# EAGLE design node (EAGLE 7.6.0)
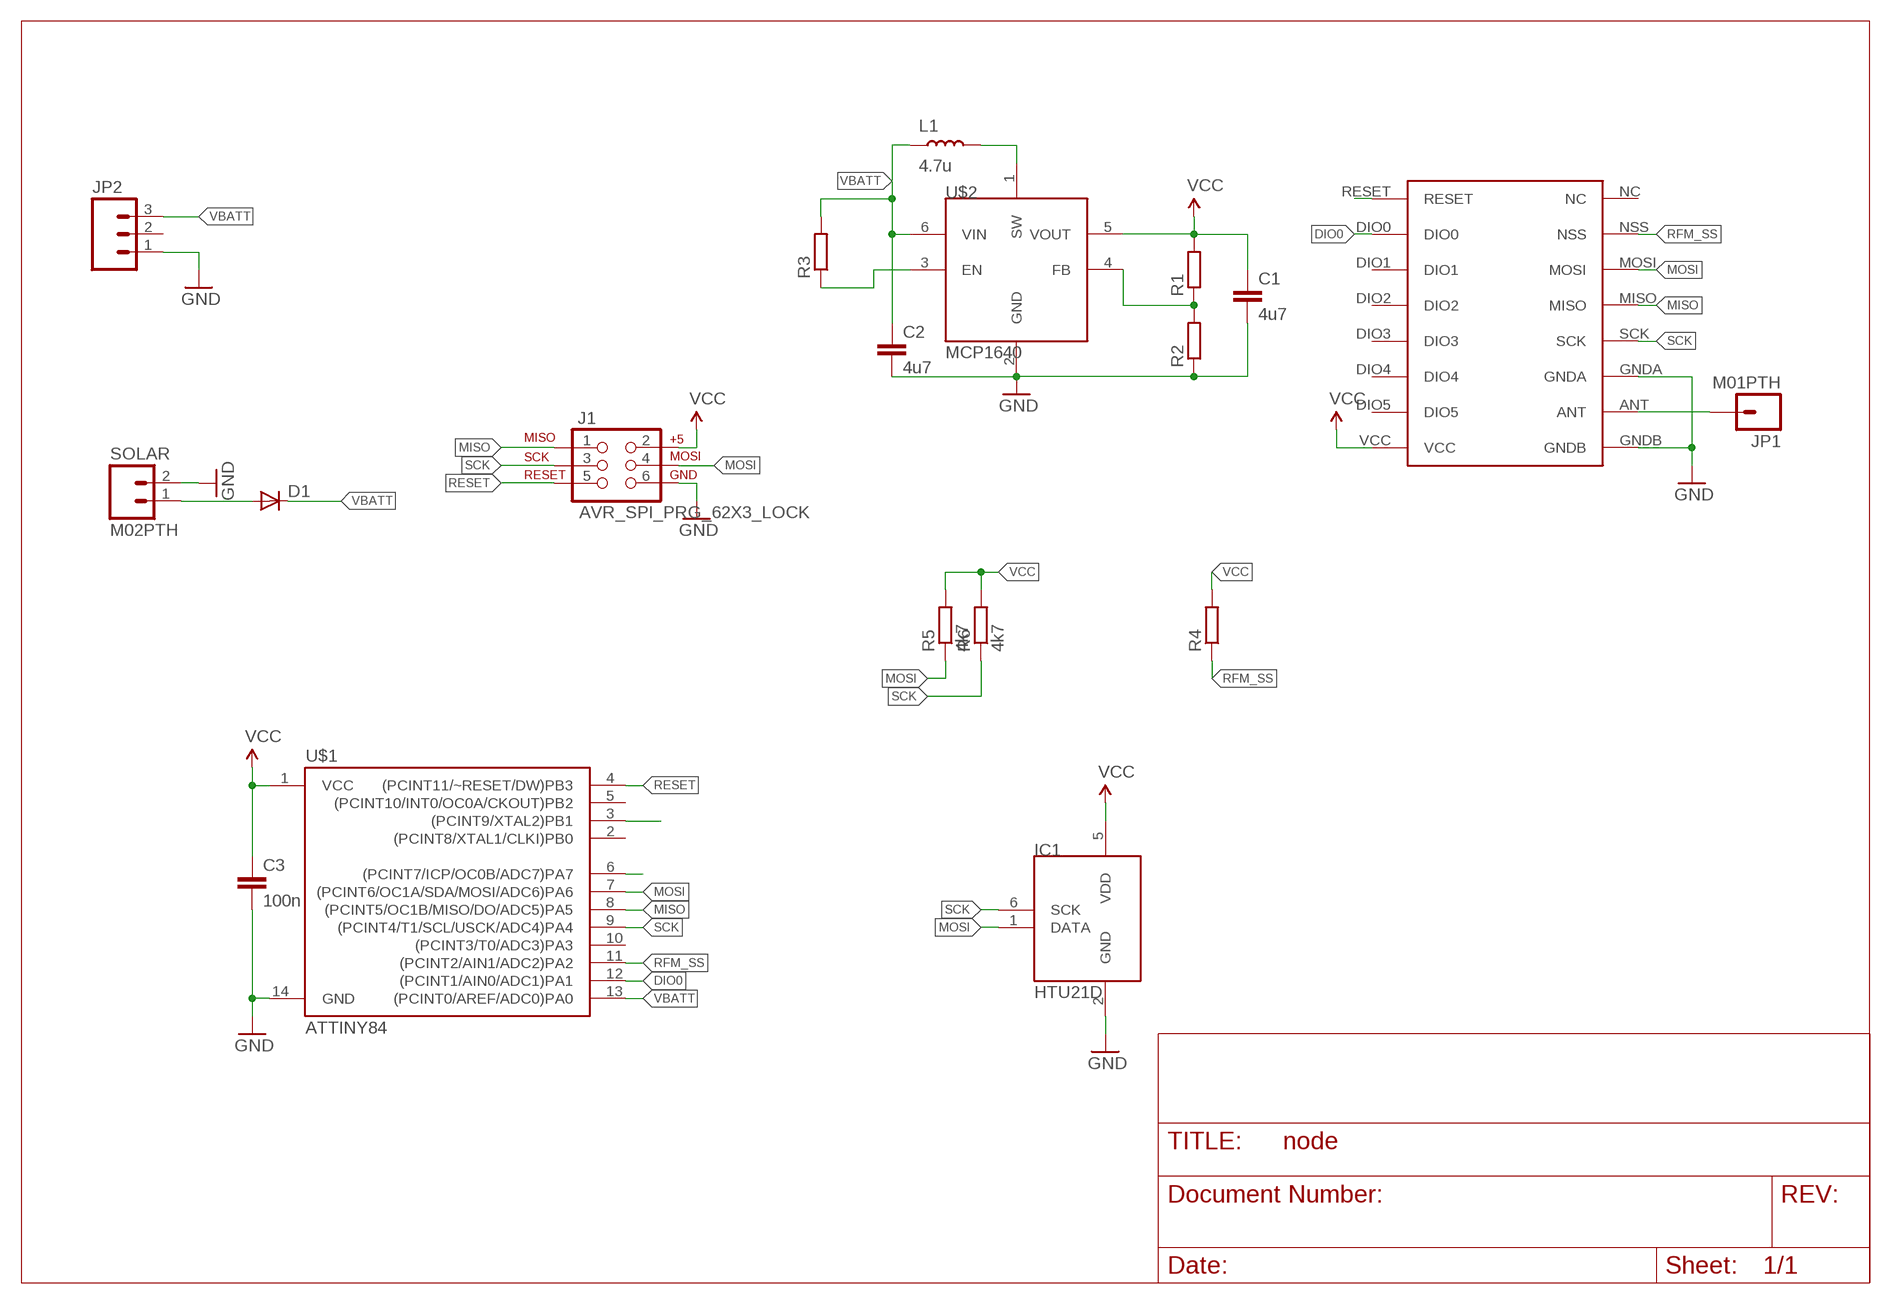
[diagram p0: schematic, sheet 1]

## Parts
C1  4u7  C-EUC0603  [C0603]
C2  4u7  C-EUC0603  [C0603]
C3  100n  C-EUC0603  [C0603]
D1  DIODE-SOD123  [SOD123]
IC1  HTU21D  [DFN6-L]
J1  AVR_SPI_PRG_62X3_LOCK  [2X3_LOCK]
JP1  M01PTH  [1X01]
JP2  M03PTH  [1X03]
L1  4.7u  INDUCTOR0603-N  [L0603-N]
R1  R-EU_R0603  [R0603]
R2  R-EU_R0603  [R0603]
R3  R-EU_R0603  [R0603]
R4  R-EU_R0603  [R0603]
R5  4k7  R-EU_R0603  [R0603]
R6  4k7  R-EU_R0603  [R0603]
SOLAR  M02PTH  [1X02]
U$1  ATTINY84  [SO14]
U$2  MCP1640  [SOT23-6]
U$4  RFM69HW  [RFM]

## Nets
DIO0: U$1.12((PCINT1/AIN0/ADC1)PA1) U$4.DIO0
EN: R3.1 U$2.3(EN)
GND: C1.2 C2.2 C3.2 IC1.2(GND) J1.6 JP2.1 R2.1 SOLAR.2 U$1.14(GND) U$2.2(GND) U$4.GNDA U$4.GNDB
MISO: J1.1 U$1.8((PCINT5/OC1B/MISO/DO/ADC5)PA5) U$4.MISO
MOSI: IC1.1(DATA) J1.4 R5.1 U$1.7((PCINT6/OC1A/SDA/MOSI/ADC6)PA6) U$4.MOSI
N$1: L1.2 U$2.1(SW)
N$2: R1.1 R2.2 U$2.4(FB)
N$3: JP1.1 U$4.ANT
N$4: U$1.3((PCINT9/XTAL2)PB1)
N$5: D1.A SOLAR.1
N$6: U$1.6((PCINT7/ICP/OC0B/ADC7)PA7)
N$7: U$4.RESET
RESET: J1.5 U$1.4((PCINT11/~RESET/DW)PB3)
RFM_SS: R4.1 U$1.11((PCINT2/AIN1/ADC2)PA2) U$4.NSS
SCK: IC1.6(SCK) J1.3 R6.1 U$1.9((PCINT4/T1/SCL/USCK/ADC4)PA4) U$4.SCK
VBATT: C2.1 D1.C JP2.3 L1.1 R3.2 U$1.13((PCINT0/AREF/ADC0)PA0) U$2.6(VIN)
VCC: C1.1 C3.1 IC1.5(VDD) J1.2 R1.2 R4.2 R5.2 R6.2 U$1.1(VCC) U$2.5(VOUT) U$4.VCC
Unconnected: JP2.2 U$1.2((PCINT8/XTAL1/CLKI)PB0) U$1.5((PCINT10/INT0/OC0A/CKOUT)PB2) U$1.10((PCINT3/T0/ADC3)PA3) U$4.DIO1 U$4.DIO2 U$4.DIO3 U$4.DIO4 U$4.DIO5 U$4.NC

## Library data of the parts
C1-C3 = rcl:C-EU: CAPACITOR, European symbol
D1 = dtb:DIODE-: DIODE
IC1 = Mine:HTU21D
J1 = SparkFun-Connectors:AVR_SPI_PRG_6: AVR ISP 6 Pin This is the reduced ISP connector for AVR programming. Common on Arduino. This footprint will take up less PCB space and can be used with a 10-pin to 6-pin adapter such as SKU: BOB-08508 **Special note about "TEST_POINT" package. The stop mask is on the top side, so if you want your programming test points to be on the bottom of your board, make sure to place this package on the bottom side of the board. This also ensure that the orientation to program from the bottom side will be correct.
JP1 = SparkFun-Connectors:M01: Header 1 Standard 1-pin 0.1" header. Use with straight break away headers (SKU : PRT-00116), right angle break away headers (PRT-00553), swiss pins (PRT-00743), machine pins (PRT-00117), and female headers (PRT-00115).
JP2 = SparkFun:M03: Header 3 Standard 3-pin 0.1" header. Use with straight break away headers (SKU : PRT-00116), right angle break away headers (PRT-00553), swiss pins (PRT-00743), machine pins (PRT-00117), and female headers (PRT-00115). Molex polarized connector foot print use with SKU : PRT-08232 with associated crimp pins and housings.
L1 = passives-7351:INDUCTOR
R1-R6 = rcl:R-EU_: RESISTOR, European symbol
SOLAR = SparkFun-Connectors:M02: Standard 2-pin 0.1" header. Use with - straight break away headers ( PRT-00116) - right angle break away headers (PRT-00553) - swiss pins (PRT-00743) - machine pins (PRT-00117) - female headers (PRT-00115) Molex polarized connector foot print use with: PRT-08233 with associated crimp pins and housings. 2.54_SCREWTERM for use with PRT-10571. 3.5mm Screw Terminal footprints for PRT-08084 5mm Screw Terminal footprints for use with PRT-08432
U$1 = SparkFun-DigitalIC:ATTINY84: Atmel 14-pin 2/4/8kB flash uC; PROD_ID: IC-11285
U$2 = ukhas:MCP1640
U$4 = hoperf:RFM69HW

## Board
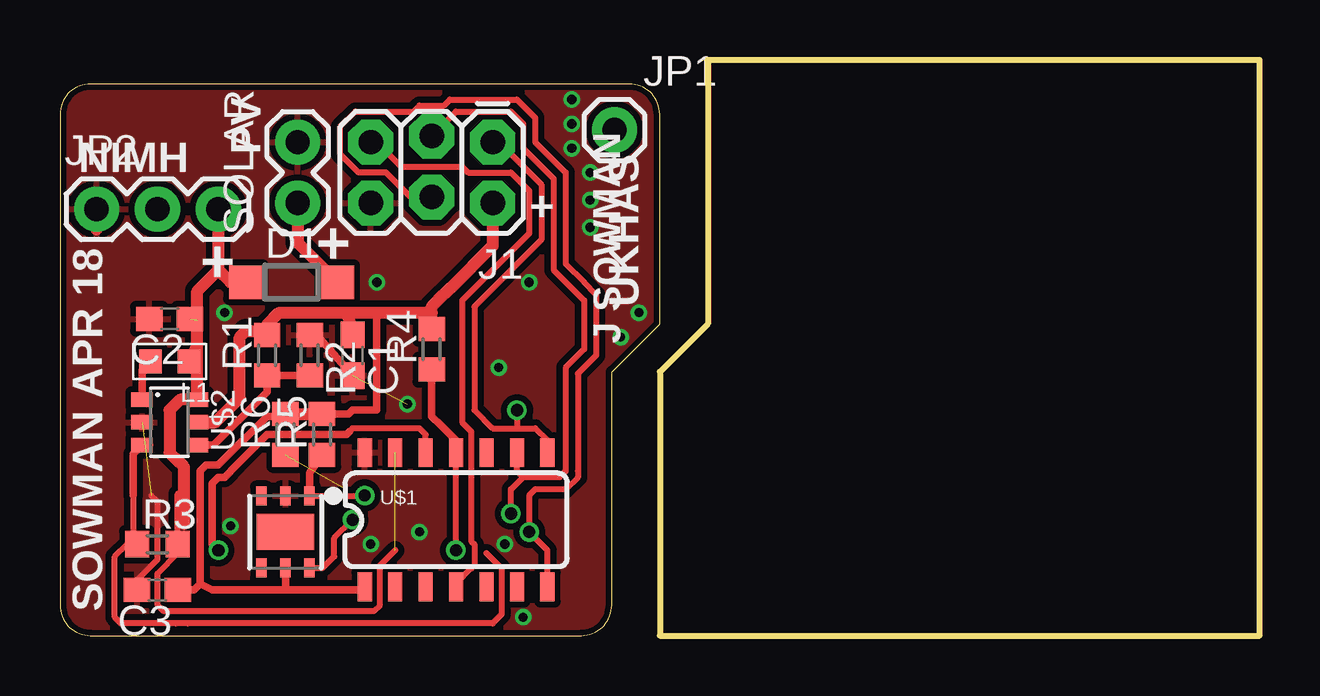
[diagram p1: board, top side]
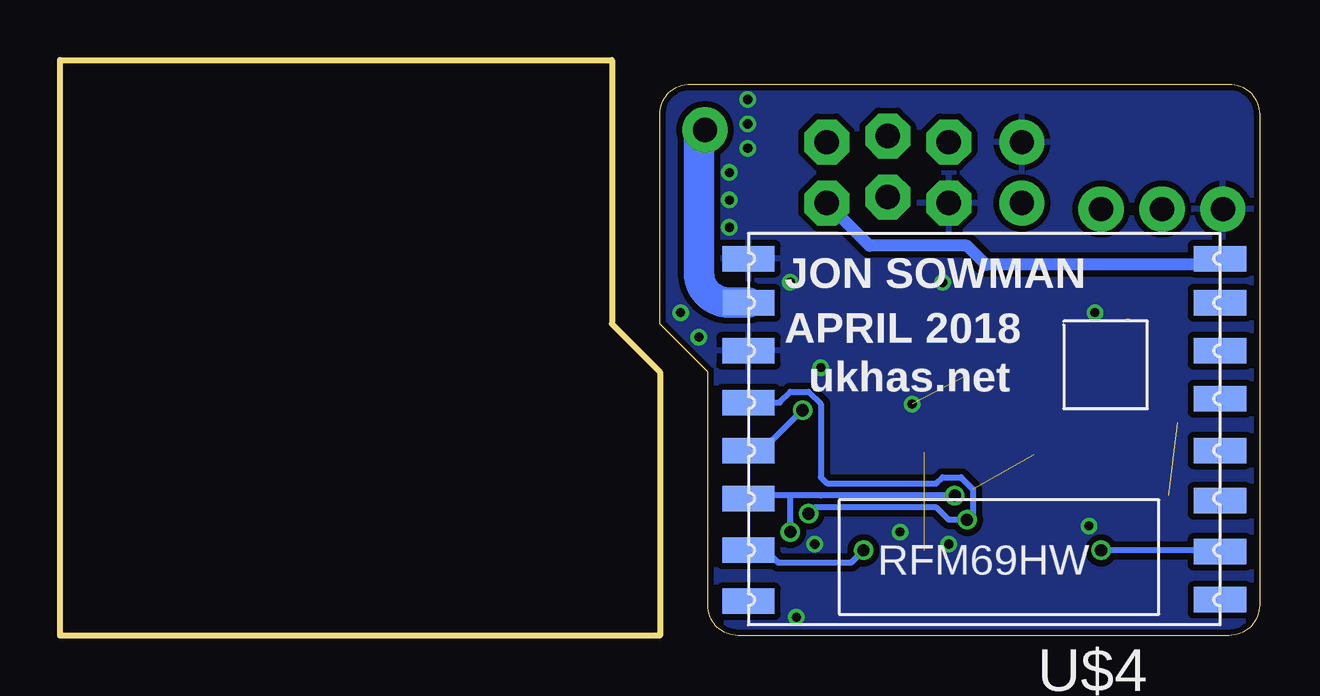
[diagram p2: board, bottom side, seen from below]

Size 50 x 24 mm. Coordinates in mm from the lower left corner, seen from the top.
Outline: 25,13 25,21.73 arc90 23.73,23 1.27,23 arc90 0,21.73 0,1.27 arc90 1.27,0 21.73,0 arc90 23,1.27 23,11 25,13
Outline: 27,24 27,13 25,11 25,0 50,0 50,24 27,24
Copper layers (1*16): Top 0.035mm / dielectric 1.5mm / Bottom 0.035mm
Design rules "dirt_cheap_dirty_boards.v1": minimum track width 5mil, minimum drill 12mil, track to track 5mil, track to pad 5mil, pad to pad 5mil, via to via 5mil, smd to smd 0mil, copper to edge 10mil, drill to drill 10mil, minimum pad ring 10mil, minimum via ring 6mil, stop-mask expansion 2mil, vias tented up to drill 25mil, thermal gap 10mil

### Footprints (pad centres in the part's own frame; a part is rotated, then mirrored left to right if it is on the bottom)
C0603 = smd 1.1 x 1: 1 -0.85,0; 2 0.85,0
SOD123 = smd 1.4 x 1.4: A 1.9,0; C -1.9,0
DFN6-L = smd 0.45 x 0.8: 1 -1,-1.5; 2 0,-1.5; 3 1,-1.5; 4 1,1.5; 5 0,1.5; 6 -1,1.5 | smd 2.4 x 1.5: EP 0,0
2X3_LOCK = drill 1.016 pad 1.88 octagon: 1 0,0; 2 0,2.54; 3 2.54,-0.254; 4 2.54,2.286; 5 5.08,0; 6 5.08,2.54
1X01 = drill 1.016 pad 1.88: 1 0,0
1X03 = drill 1.016 pad 1.88: 1 0,0; 2 2.54,0; 3 5.08,0
L0603-N = smd 0.95 x 1: 1 -0.8,0; 2 0.8,0
R0603 = smd 1 x 1.1: 1 -0.85,0; 2 0.85,0
1X02 = drill 1.016 pad 1.88: 1 0,0; 2 2.54,0
SO14 = smd 0.6 x 1.2: 1 -3.81,-2.8; 2 -2.54,-2.8; 3 -1.27,-2.8; 4 0,-2.8; 5 1.27,-2.8; 6 2.54,-2.8; 7 3.81,-2.8; 8 3.81,2.8; 9 2.54,2.8; 10 1.27,2.8; 11 0,2.8; 12 -1.27,2.8; 13 -2.54,2.8; 14 -3.81,2.8
SOT23-6 = smd 0.6 x 0.9: 1 -0.95,-1.15; 2 0,-1.15; 3 0.95,-1.15; 4 0.95,1.15; 5 0,1.15; 6 -0.95,1.15
RFM = smd 2.184 x 1.067: ANT 19.651,2.889; DIO0 0,13.27; DIO1 0,11.143; DIO2 0,9.047; DIO3 0,6.889; DIO4 0,4.889; DIO5 0,2.889; GNDA 19.651,4.889; GNDB 19.651,1.048; MISO 19.651,9.047; MOSI 19.651,11.047; NC 19.651,15.334; NSS 19.651,13.206; RESET 0,15.27; SCK 19.651,7.048; VCC 0,1.048

### Placement (x,y rotation side)
C1  12.19,11.68 270 top
C2  4.57,13.21 180 top
C3  4.06,1.91 180 top
D1  9.65,14.73 0 top
IC1  9.4,4.32 180 top
J1  18.03,20.57 180 top
JP1  23.11,21.08 0 top
JP2  1.52,17.78 0 top
L1  4.57,11.43 180 top
R1  8.64,11.68 90 top
R2  10.41,11.68 270 top
R3  4.06,3.81 0 top
R4  15.49,11.94 90 top
R5  10.92,8.38 90 top
R6  9.4,8.38 90 top
SOLAR  9.91,18.03 90 top
U$1  16.51,4.83 0 top
U$2  4.57,8.89 270 top
U$4  1.65,16.76 180 bottom

### Tracks (layer width: path | path; a pad name or v marks a point on that pad's centre or on a via)
DIO0  (via drill 0.51)
  Top 0.254: U$1.12 15.24,8.13 15.24,8.38 14.99,8.64 12.19,8.64 | 12.19,8.64 12.06,8.51 | 12.06,8.51 11.94,8.38 12.06,8.51 | 12.19,8.64 12.06,8.51
  Top 0.305: 12.06,8.51 11.94,8.38 8.64,8.38 7.37,7.11 6.86,6.6 6.6,6.6 6.35,6.35 6.35,3.81 v6.6,3.56
  Bottom 0.254: U$4.DIO0 1.71,3.56 v6.6,3.56
EN
  Top 0.254: 17.78,3.43 18.41,2.79 18.41,0.89 18.03,0.51 5.33,0.51 4.83,0.51 2.54,0.51 2.29,0.76 2.29,3.3 2.79,3.81 R3.1 | R3.1 3.3,3.81 R3.1 | 3.05,5.84 3.05,3.98 R3.1
  Top 0.305: 3.74,7.94 U$2.3 3.05,7.57 3.05,5.84
GND  (via drill 0.38)  (2 unrouted)
  Top 0.254: C3.2 3.21,2.33 4.06,3.17 4.06,5.59 3.81,5.84
  Top 0.305: R2.1 10.49,12.79 C1.2
  Top 0.508: JP2.1 1.52,16.93
  other vias: 18.29,11.18 12.95,3.81 14.99,4.32 21.34,22.35 23.37,12.45 22.1,19.3 22.1,17.02 13.21,14.73 14.48,9.65 19.3,0.76 6.86,13.46 21.34,21.34 21.34,20.32 22.1,18.16 24.13,13.46 19.56,14.73 18.54,3.81 7.11,4.57
  pour Top (isolate 0.254): 0,23.11 24.89,23.11 24.89,0 0,0
  pour Bottom (isolate 0.254): 0,23.11 24.89,23.11 24.89,0 0,0
MISO  (via drill 0.51)
  Top 0.254: U$1.8 20.32,8.13 19.81,8.64 19.05,8.64 | 19.05,8.64 18.03,8.64 17.27,9.4 17.27,13.72 20.07,16.51 20.07,18.8 18.54,20.32 18.29,20.32 J1.1 | v19.05,9.4 19.05,8.64
  Bottom 0.254: U$4.MISO 20.73,7.72 v19.05,9.4
MOSI  (via drill 0.51)
  Top 0.254: J1.4 14.61,18.29 13.59,19.3 12.45,19.3 11.68,20.07 11.68,21.21 12.32,21.84 14.73,21.84 14.99,22.1 16,22.1 16.26,22.35 19.05,22.35 19.81,21.59 19.81,20.57 21.08,19.3 21.08,15.49 21.84,14.73 22.35,14.22 22.35,11.68 21.59,10.92 21.59,6.86 21.59,6.6 21.08,6.1 19.81,6.1 19.56,5.84 v19.56,4.32 20.32,3.56 U$1.7 | IC1.1 12.68,5.82 v12.7,5.84
  Top 0.305: IC1.1 10.4,6.79 R5.1
  Bottom 0.254: v12.7,5.84 18.29,5.84 19.56,5.84 | 19.56,5.84 21.18,5.84 U$4.MOSI | v19.56,4.32 19.56,5.84
N$1
  Top 0.305: U$2.1 3.42,11.08 L1.2
N$2
  Top 0.305: R2.2 R1.1 8.64,10.16 8.38,9.91 6.42,7.94 U$2.4
N$3
  Bottom 1.27: U$4.ANT 22.1,13.88 arc90 23.37,15.14 23.37,19.05 23.37,19.3 23.37,20.47 arc45 JP1.1
N$5
  Top 0.508: 11.55,15.12 D1.A 9.91,16.38 SOLAR.1
RESET
  Top 0.254: U$1.4 16.51,2.16 17.14,2.79 17.27,2.92 17.27,3.81 17.14,3.94 17.14,7.49 17.14,7.62 17.14,8.51 16.76,8.89 16.76,13.97 19.56,16.76 19.56,18.54 18.8,19.3 17.02,19.3 16.76,19.56 14.22,19.56 13.21,20.57 J1.5
RFM_SS  (via drill 0.51)
  Top 0.254: v16.51,3.56 U$1.11
  Top 0.305: R4.1 15.49,9.14 15.88,8.76 | 15.88,8.76 16.26,8.38 | U$1.11 16.51,8.13 15.88,8.76
  Bottom 0.254: U$4.NSS 20.58,3.56 20.07,3.05 17.02,3.05 v16.51,3.56
SCK  (via drill 0.51)  (1 unrouted)
  Top 0.254: J1.3 16.51,21.84 18.8,21.84 19.3,21.34 19.3,20.32 20.57,19.05 20.57,15.24 21.84,13.97 21.84,11.94 21.08,11.18 21.08,6.86 20.83,6.6 19.3,6.6 | 19.3,6.6 19.18,6.73 19.05,6.86 U$1.9 | IC1.6 10.95,2.82 11.43,3.3 11.43,4.06 v12.19,4.83 | 19.3,6.6 18.8,6.1 v18.8,5.08
  Bottom 0.254: v18.8,5.08 18.54,5.33 13.46,5.33 12.95,4.83 v12.19,4.83 11.94,5.08 11.94,6.1 12.45,6.6 13.21,6.6 13.46,6.35 18.03,6.35 18.29,6.6 18.29,9.65 18.8,10.16 19.56,10.16 20,9.72 U$4.SCK
VBATT  (2 unrouted)
  Top 0.254: 13.97,3.56 13.34,2.92 13.34,1.27 13.08,1.02 11.56,1.02 5.33,1.02 4.32,1.02 4.06,1.27 4.06,2.58 4.91,3.43 R3.2 4.91,5.91 5.17,4.64
  Top 0.305: L1.1 5.66,11.43 5.67,11.44
  Top 0.508: U$2.6 5.72,13.16 5.72,13.46 5.72,14.36 6.6,15.24 | 5.66,11.94 5.67,11.44 U$2.6 | 5.17,4.64 5.17,7.02 4.85,7.34 4.57,7.62 4.57,9.4 5.01,9.84 U$2.6 | JP2.3 6.6,15.24 | D1.C 7.11,14.73 6.6,15.24
VCC
  Top 0.305: 5.84,2.16 5.84,3.56 5.84,6.86 6.1,7.11 6.6,7.11 8.64,9.14 9.31,9.14 R6.2 | 5.84,2.16 6.35,1.91 8.78,1.91 9.4,1.91 | 9.4,1.91 11.82,1.91 12.58,1.91 U$1.1 | IC1.5 9.4,1.91 | 13.21,13.46 13.21,10.16 13.21,9.4 12.19,9.4 12.03,9.23 R5.2 | C3.1 5.59,1.91 5.84,2.16
  Top 0.508: 11.93,13.46 9.14,13.46 8.64,12.95 R1.2 8.55,12.7 7.75,12.7 7.49,12.45 7.49,9.91 6.48,8.89 U$2.5 | 11.93,13.46 12.19,12.79 C1.1 | 11.93,13.46 13.21,13.46 | R6.2 R5.2 | J1.2 18.03,16.51 18.03,16.26 16.26,14.48 15.75,13.97 15.49,13.72 15.49,13.46 | R4.2 15.49,13.46 | 11.93,13.46 15.49,13.46
  Bottom 0.508: U$4.VCC 1.75,15.46 11.4,15.46 12.19,16.26 16.26,16.26 J1.2

### Text on the board
tPlace: PV | NIMH | + | + | + | UKHAS | SOWMAN APR 18
bPlace: JON SOWMAN | APRIL 2018 | ukhas.net
tNames: J SOWMAN